# EAGLE design VIVA Audio Amp (EAGLE 6.3)

## Sheet 1 of 2
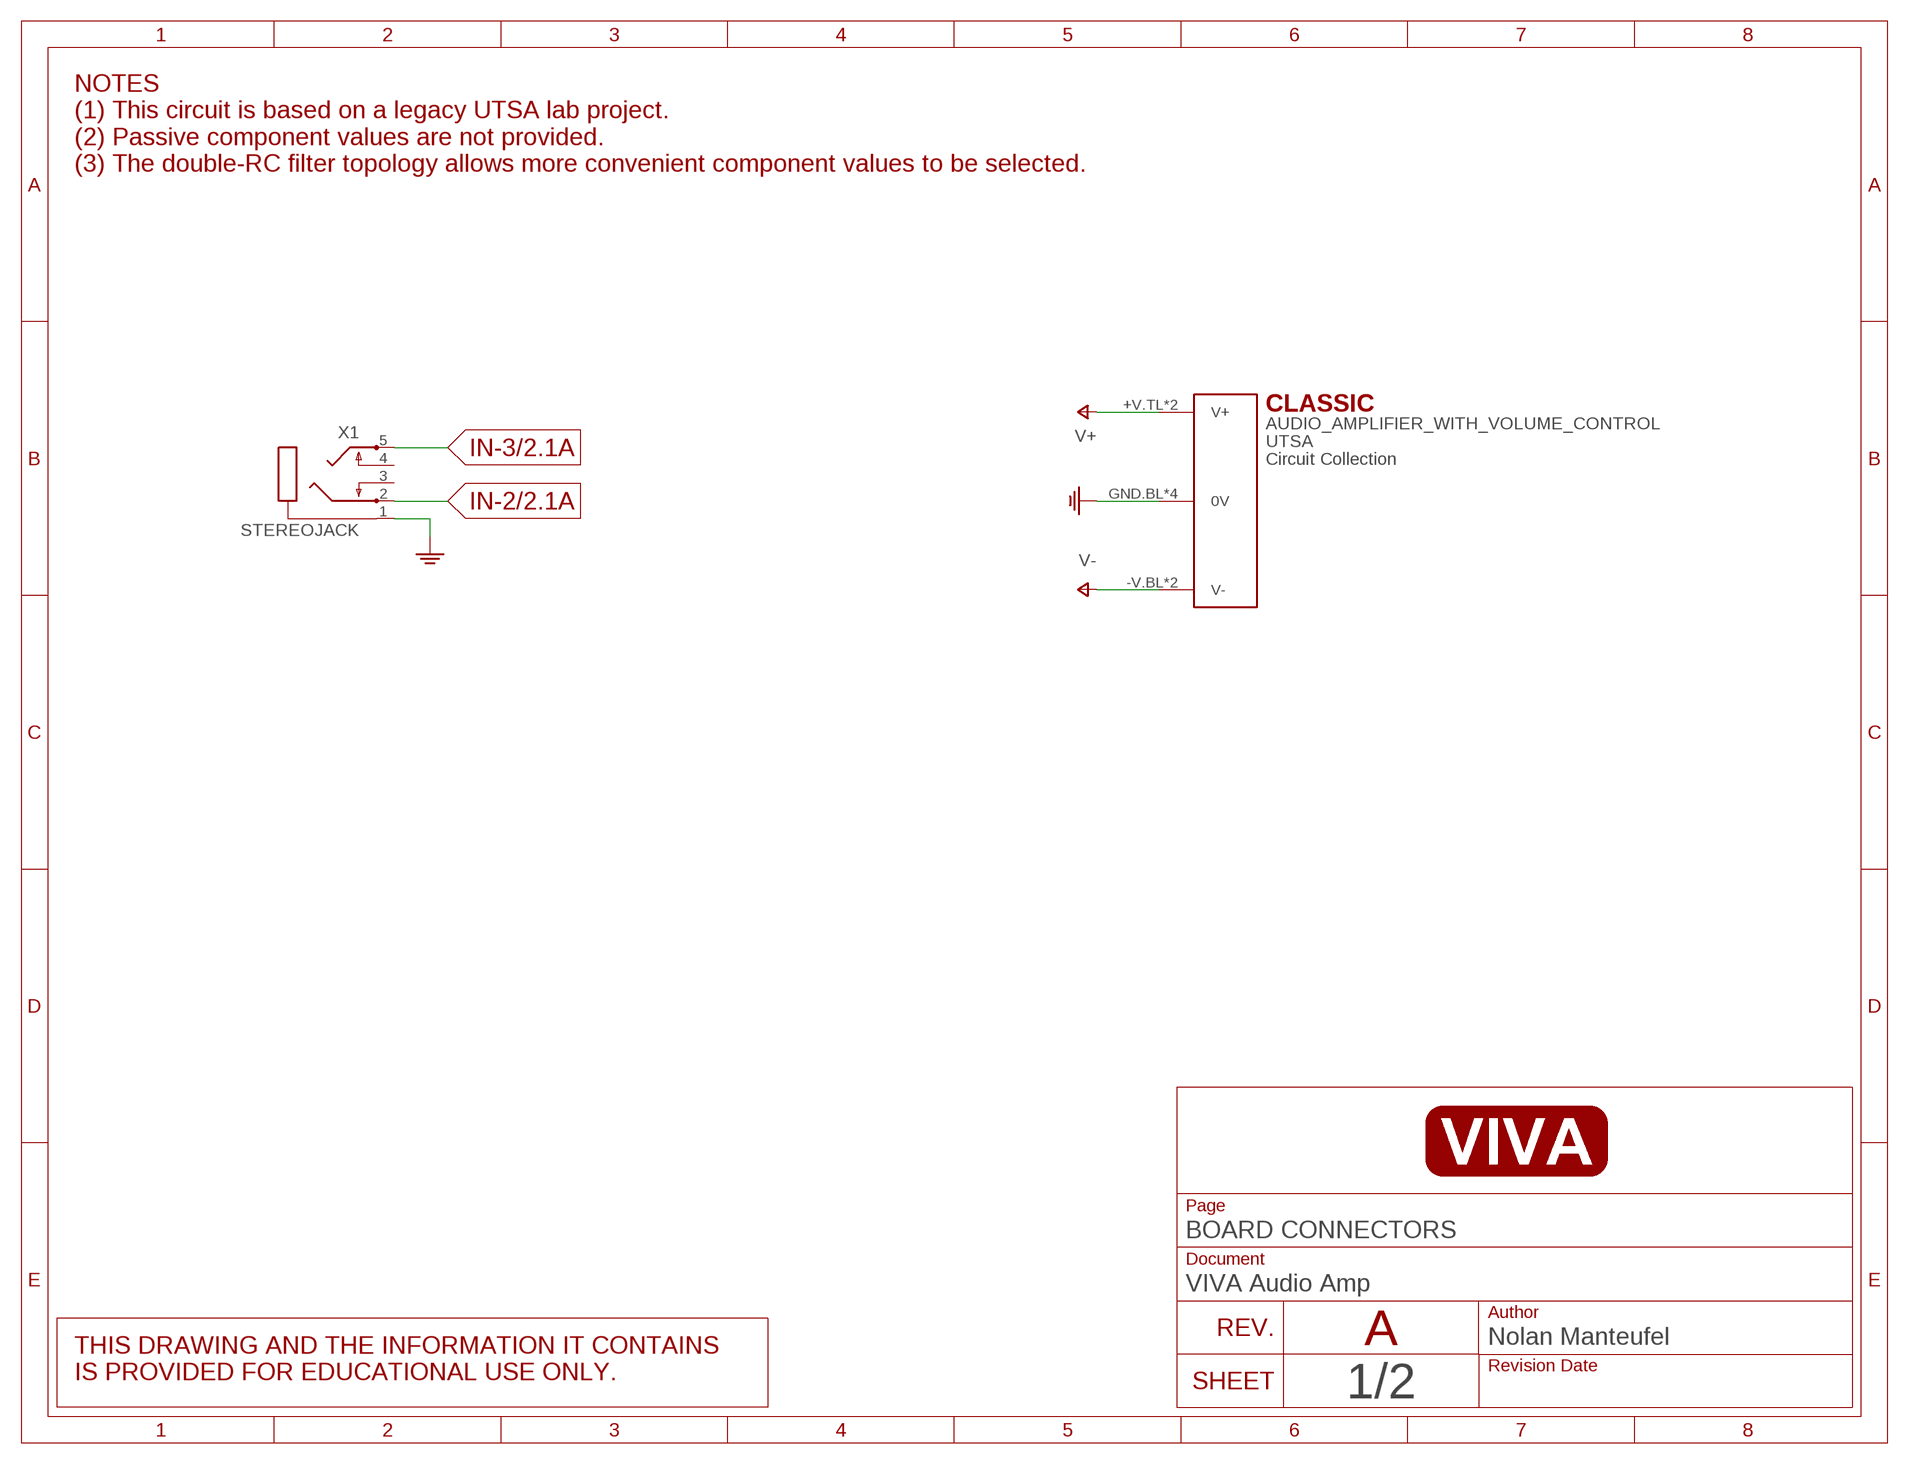
[diagram p0: schematic, sheet 1]

### Parts
AUDIO_AMPLIFIER_WITH_VOLUME_CONTROL  UTSA  CLASSIC_PCB35  [CLASSIC_3-5"]
X1  STEREOJACK  [STX3100]

### Nets
GND: AUDIO_AMPLIFIER_WITH_VOLUME_CONTROL.GND.BL(0V) AUDIO_AMPLIFIER_WITH_VOLUME_CONTROL.GND.BR(0V) AUDIO_AMPLIFIER_WITH_VOLUME_CONTROL.GND.TL(0V) AUDIO_AMPLIFIER_WITH_VOLUME_CONTROL.GND.TR(0V) X1.1 ; also sheet 2
IN-2: X1.2 ; also sheet 2
IN-3: X1.5 ; also sheet 2
V+: AUDIO_AMPLIFIER_WITH_VOLUME_CONTROL.+V.TL(V+) AUDIO_AMPLIFIER_WITH_VOLUME_CONTROL.+V.TR(V+) ; also sheet 2
V-: AUDIO_AMPLIFIER_WITH_VOLUME_CONTROL.-V.BL(V-) AUDIO_AMPLIFIER_WITH_VOLUME_CONTROL.-V.BR(V-) ; also sheet 2
Unconnected: X1.3 X1.4

### Notes on the sheet
- NOTES
  (1) This circuit is based on a legacy UTSA lab project.
  (2) Passive component values are not provided.
  (3) The double-RC filter topology allows more convenient component values to be selected.
- A

## Sheet 2 of 2
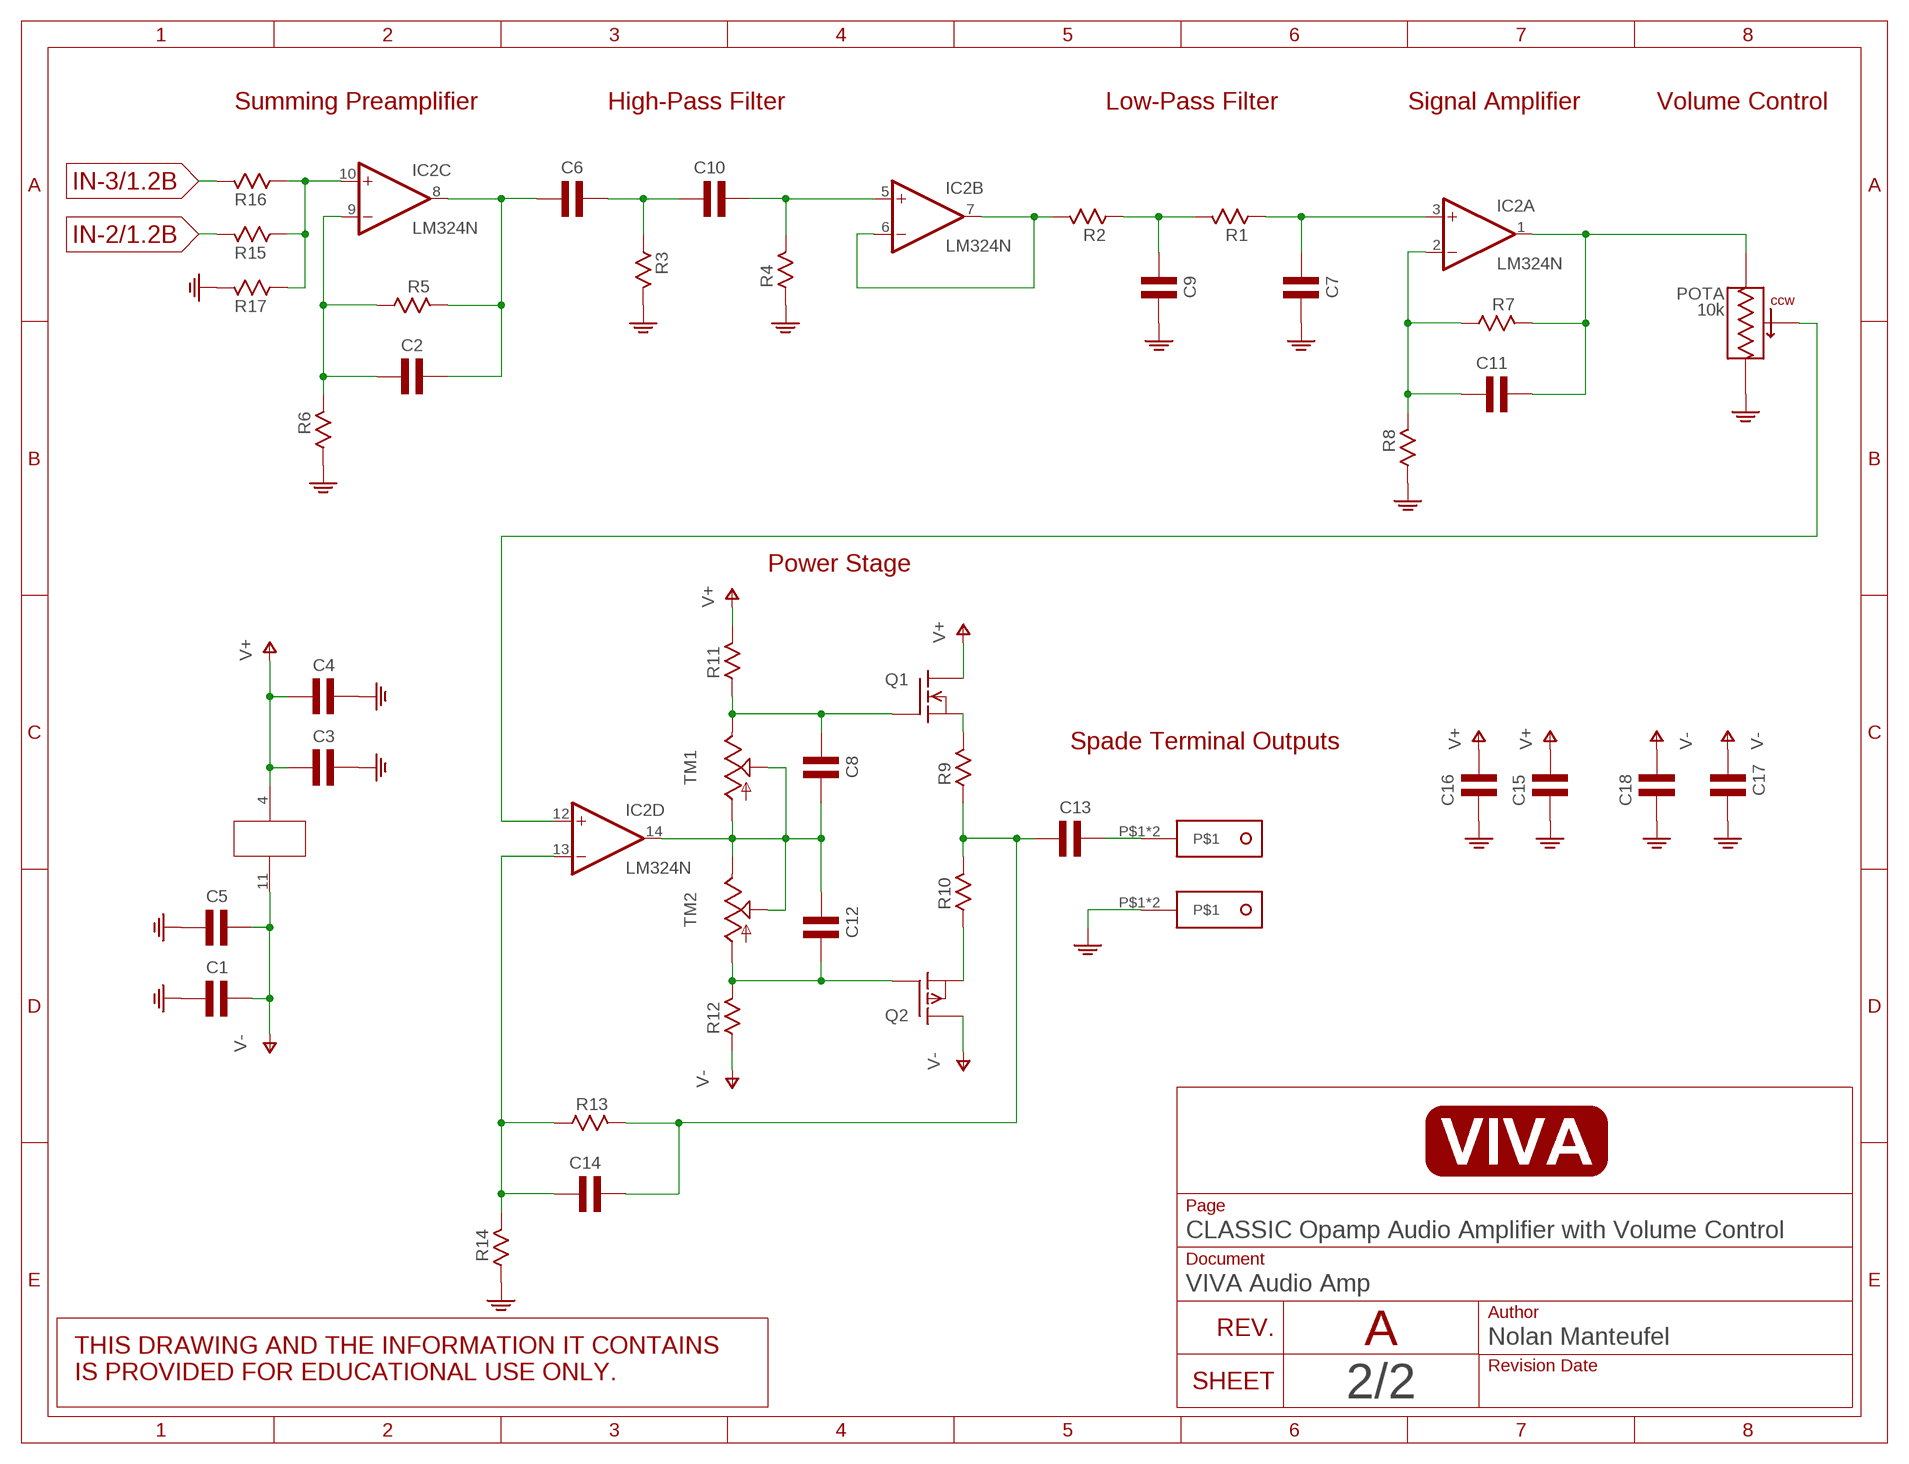
[diagram p1: schematic, sheet 2]

### Parts
C1  COVAL  [C050-024X044]
C2  COVAL  [C050-024X044]
C3  COVAL  [C050-024X044]
C4  C2.5-10  [E2,5-5]
C5  C2.5-10  [E2,5-5]
C6  COVAL  [C050-024X044]
C7  COVAL  [C050-024X044]
C8  COVAL  [C050-024X044]
C9  COVAL  [C050-024X044]
C10  COVAL  [C050-024X044]
C11  COVAL  [C050-024X044]
C12  COVAL  [C050-024X044]
C13  C3.5-10  [E3,5-10]
C14  COVAL  [C050-024X044]
C15  C2.5-10  [E2,5-5]
C16  COVAL  [C050-024X044]
C17  C2.5-10  [E2,5-5]
C18  COVAL  [C050-024X044]
IC2  LM324N  [DIL14]
POT  10k  POTENTIOMETER  [WH148]
Q1  N-MOSFETTO220V  [TO220V]
Q2  P-MOSFETTO220V  [TO220V]
R1  R204-7  [0204/7]
R2  R204-7  [0204/7]
R3  R204-7  [0204/7]
R4  R204-7  [0204/7]
R5  R204-7  [0204/7]
R6  R204-7  [0204/7]
R7  R204-7  [0204/7]
R8  R204-7  [0204/7]
R9  R204-7  [0204/7]
R10  R204-7  [0204/7]
R11  R204-7  [0204/7]
R12  R204-7  [0204/7]
R13  R204-7  [0204/7]
R14  R204-7  [0204/7]
R15  R204-7  [0204/7]
R16  R204-7  [0204/7]
R17  R204-7  [0204/7]
TM1  TRIM6MM  [6MM]
TM2  TRIM6MM  [6MM]
U$2  SPADE-TAB  [SPADE-TAB-6.3MM]
U$3  SPADE-TAB  [SPADE-TAB-6.3MM]

### Nets
GND: C1.1 C3.2 C4.- C5.+ C7.1 C9.1 C15.- C16.2 C17.+ C18.2 POT.4.FL(A:1.L) R3.2 R4.1 R6.2 R8.2 R14.2 R17.1 U$3.P$1 U$3.P$2 ; also sheet 1
IN-2: R15.1 ; also sheet 1
IN-3: R16.1 ; also sheet 1
INPUT: IC2.10(C:+IN) R15.2 R16.2 R17.2
N$1: C9.2 R1.2 R2.1
N$2: C2.2 IC2.9(C:-IN) R5.2 R6.1
N$3: C2.1 C6.2 IC2.8(C:OUT) R5.1
N$4: C7.2 IC2.3(A:+IN) R1.1
N$5: IC2.6(B:-IN) IC2.7(B:OUT) R2.2
N$6: Q2.3(S) R10.1
N$7: C10.1 IC2.5(B:+IN) R4.2
N$8: C6.1 C10.2 R3.1
N$9: C11.1 IC2.1(A:OUT) POT.6.FR(A:3.R) R7.1
N$10: C11.2 IC2.2(A:-IN) R7.2 R8.1
N$11: C8.2 Q1.1(G) R11.1 TM1.E
N$12: C12.1 Q2.1(G) R12.2 TM2.A
N$14: C13.+ C14.1 R9.1 R10.2 R13.1
N$15: Q1.3(S) R9.2
N$16: C13.- U$2.P$1 U$2.P$2
N$17: IC2.12(D:+IN) POT.5.FC(A:2.C)
N$19: C14.2 IC2.13(D:-IN) R13.2 R14.1
N$20: C8.1 C12.2 IC2.14(D:OUT) TM1.A TM1.S TM2.E TM2.S
V+: C3.1 C4.+ C15.+ C16.1 Q1.2(D) R11.2 ; also sheet 1
V-: C1.2 C5.- C17.- C18.1 IC2.11(P:V-) Q2.2(D) R12.1 ; also sheet 1
Unconnected: POT.1.BL(B:1.L) POT.2.BC(B:2.C) POT.3.BR(B:3.R)

### Notes on the sheet
- Summing Preamplifier | High-Pass Filter | Low-Pass Filter | Signal Amplifier | Volume Control
- Power Stage
- Spade Terminal Outputs
- A

## Power pins joined to a net without a drawn wire
V+: IC2.4(P:V+)

## Library data of the parts
AUDIO_AMPLIFIER_WITH_VOLUME_CONTROL = nolan-utsa:CLASSIC_PCB
C1-C18 = nolan-utsa:C
IC2 = nolan-utsa:LM324: OP AMP
POT = nolan-utsa:POTENTIOMETER
Q1 = nolan-utsa:N-MOSFET
Q2 = nolan-utsa:P-MOSFET
R1-R17 = nolan-utsa:R
TM1 TM2 = nolan-utsa:TRIM
U$2 U$3 = nolan-utsa:SPADE-TAB
X1 = adafruit:STEREOJACK: MIC/HEADPHONE JACK Stereo jack with two switches. Kycon STX3100, CUI SJ1-3555NG and/or 4UCon 05544

## Board
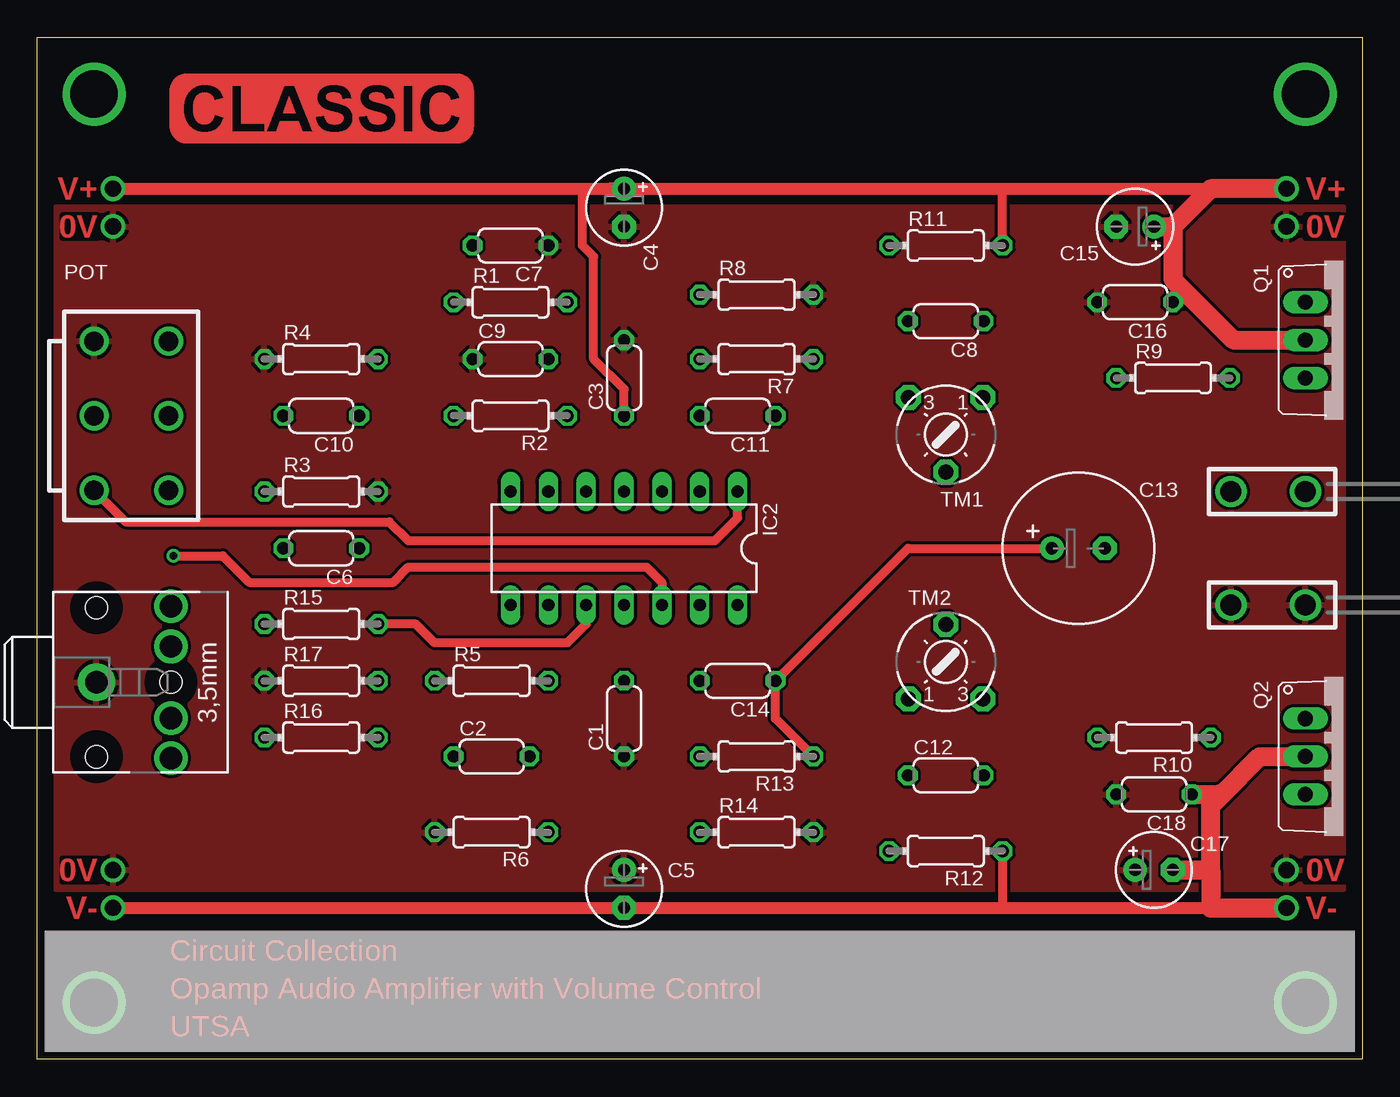
[diagram p2: board, top side]
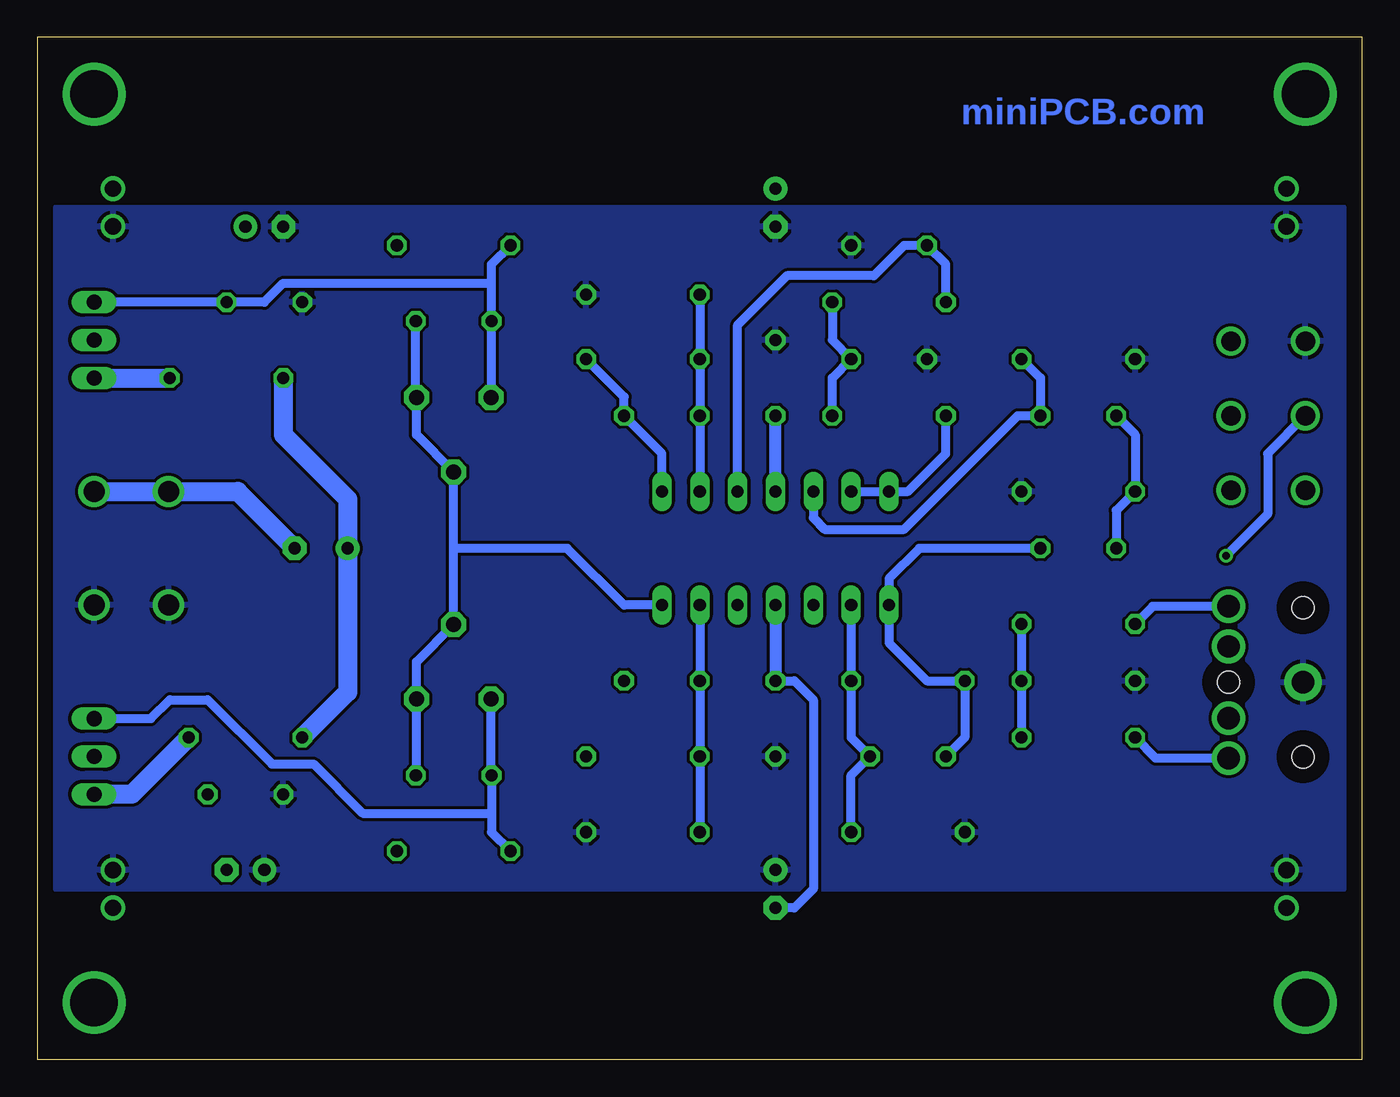
[diagram p3: board, bottom side, seen from below]

Size 88.9 x 68.58 mm. Coordinates in mm from the lower left corner, seen from the top.
Copper layers (1*16): Top 0.035mm / dielectric 1.5mm / Bottom 0.035mm
Design rules "default *": minimum track width 10mil, minimum drill 24mil, track to track 8mil, track to pad 8mil, pad to pad 8mil, via to via 8mil, smd to smd 8mil, copper to edge 40mil, drill to drill 8mil, minimum pad ring 10mil, minimum via ring 8mil, stop-mask expansion 4mil, vias tented up to drill 20mil, thermal gap 10mil

### Footprints (pad centres in the part's own frame; a part is rotated, then mirrored left to right if it is on the bottom)
CLASSIC_3-5" = drill 1.1: +V.TL 5.08,58.42; +V.TR 83.82,58.42; -V.BL 5.08,10.16; -V.BR 83.82,10.16; GND.BL 5.08,12.7; GND.BR 83.82,12.7; GND.TL 5.08,55.88; GND.TR 83.82,55.88 | drill 3.2: H.BL 3.81,3.81; H.BR 85.09,3.81; H.TL 3.81,64.77; H.TR 85.09,64.77
C050-024X044 = drill 0.813 octagon: 1 -2.54,0; 2 2.54,0
E2,5-5 = drill 0.813 pad 1.6: + -1.27,0 | drill 0.813 pad 1.6 octagon: - 1.27,0
E3,5-10 = drill 0.813 pad 1.6: + -1.778,0 | drill 0.813 pad 1.6 octagon: - 1.778,0
DIL14 = drill 0.813 long: 1 -7.62,-3.81; 2 -5.08,-3.81; 3 -2.54,-3.81; 4 0,-3.81; 5 2.54,-3.81; 6 5.08,-3.81; 7 7.62,-3.81; 8 7.62,3.81; 9 5.08,3.81; 10 2.54,3.81; 11 0,3.81; 12 -2.54,3.81; 13 -5.08,3.81; 14 -7.62,3.81
WH148 = drill 1.3: 1.BL -5,5; 2.BC 0,5; 3.BR 5,5; 4.FL -5,0; 5.FC 0,0; 6.FR 5,0
TO220V = drill 1.016 long: 1 -2.54,-2.54; 2 0,-2.54; 3 2.54,-2.54
0204/7 = drill 0.813 octagon: 1 -3.81,0; 2 3.81,0
6MM = drill 1 pad 1.676 octagon: A -2.5,-2.5; E 2.5,-2.5; S 0,2.5
SPADE-TAB-6.3MM = drill 1.4: P$1 0,0; P$2 0,5
STX3100 = drill 1.5 pad 2.54: 1 2.7,-0.1 | drill 1.5: 2 7.7,5; 3 7.7,2.3; 4 7.7,-2.5; 5 7.7,-5.2 | hole 1.5: 2.7,4.9; 2.7,-5.1; 7.7,-0.1

### Placement (x,y rotation side)
AUDIO_AMPLIFIER_WITH_VOLUME_CONTROL  0,0 0 top
C1  39.37,22.86 90 top
C2  30.48,20.32 0 top
C3  39.37,45.72 90 top
C4  39.37,57.15 270 top
C5  39.37,11.43 270 top
C6  19.05,34.29 0 top
C7  31.75,54.61 180 top
C8  60.96,49.53 180 top
C9  31.75,46.99 0 top
C10  19.05,43.18 180 top
C11  46.99,43.18 180 top
C12  60.96,19.05 0 top
C13  69.85,34.29 0 top
C14  46.99,25.4 180 top
C15  73.66,55.88 180 top
C16  73.66,50.8 180 top
C17  74.93,12.7 0 top
C18  74.93,17.78 180 top
IC2  39.37,34.29 180 top
POT  3.81,43.18 270 top
Q1  87.63,48.26 270 top
Q2  87.63,20.32 270 top
R1  31.75,50.8 0 top
R2  31.75,43.18 180 top
R3  19.05,38.1 0 top
R4  19.05,46.99 0 top
R5  30.48,25.4 0 top
R6  30.48,15.24 180 top
R7  48.26,46.99 180 top
R8  48.26,51.31 0 top
R9  76.2,45.72 0 top
R10  74.93,21.59 180 top
R11  60.96,54.61 0 top
R12  60.96,13.97 180 top
R13  48.26,20.32 180 top
R14  48.26,15.24 0 top
R15  19.05,29.21 0 top
R16  19.05,21.59 0 top
R17  19.05,25.4 0 top
TM1  60.96,41.91 180 top
TM2  60.96,26.67 0 top
U$2  85.09,38.1 90 top
U$3  85.09,30.48 90 top
X1  1.27,25.4 0 top

### Tracks (layer width: path | path; a pad name or v marks a point on that pad's centre or on a via)
GND
  pour Bottom: 1.27,11.43 87.63,11.43 87.63,57.15 1.27,57.15
  pour Top: 1.27,11.43 87.63,11.43 87.63,57.15 1.27,57.15
IN-2
  Bottom 0.61: X1.2 14.05,30.4 R15.1
IN-3
  Bottom 0.61: X1.5 13.85,20.2 R16.1
INPUT
  Top 0.61: IC2.10 36.83,29.21 35.56,27.94 26.67,27.94 25.4,29.21 R15.2
  Bottom 0.61: R15.2 R17.2 R16.2
N$1
  Bottom 0.61: R2.1 35.56,45.72 C9.2 35.56,48.26 R1.2
N$2
  Bottom 0.61: IC2.9 R5.2 34.29,21.59 C2.2 34.29,19.05 R6.1
N$3
  Bottom 0.61: C6.2 29.72,34.29 31.75,32.26 IC2.8 31.75,27.94 29.21,25.4 R5.1 26.67,21.59 C2.1
N$4
  Bottom 0.61: IC2.3 41.91,49.28 38.61,52.58 32.77,52.58 30.73,54.61 C7.2 27.94,53.34 R1.1
N$5
  Bottom 0.61: IC2.6 IC2.7 30.48,38.1 27.94,40.64 R2.2
N$6
  Bottom 1.27: R10.1 82.55,17.78 Q2.3
N$7
  Bottom 0.61: R4.2 21.59,45.72 C10.1 23.11,43.18 30.73,35.56 36.07,35.56 36.83,36.32 IC2.5
N$8
  Bottom 0.61: C10.2 15.24,41.91 R3.1 16.51,36.83 C6.1
N$9
  Top 0.61: POT.6.FR 5.92,36.07 23.62,36.07 24.89,34.8 45.47,34.8 46.99,36.32 IC2.1
  Bottom 0.61: IC2.1 46.99,40.64 C11.1 49.53,44.45 R7.1
N$10
  Bottom 0.61: R8.1 R7.2 C11.2 IC2.2
N$11
  Bottom 0.61: TM1.E 58.42,44.45 C8.2 58.42,52.07 | Q1.1 73.66,50.8 72.39,52.07 58.42,52.07 | 58.42,52.07 58.42,53.34 R11.1
N$12
  Bottom 0.61: TM2.A 58.46,19.09 C12.1 58.42,16.51 | 58.42,16.51 58.42,15.24 R12.2 | Q2.1 81.28,22.86 80.01,24.13 77.47,24.13 73.15,19.81 70.36,19.81 67.06,16.51 58.42,16.51
N$14
  Top 0.61: C13.+ 58.42,34.29 C14.1 49.53,22.86 R13.1
  Bottom 1.27: R9.1 72.39,41.91 68.07,37.59 C13.+ 68.07,24.64 R10.2
N$15
  Bottom 1.27: Q1.3 R9.2
N$16
  Bottom 1.27: U$2.P$1 U$2.P$2 75.44,38.1 C13.-
N$17  (via drill 0.5)
  Top 0.61: v9.14,33.78 12.45,33.78 14.22,32 23.88,32 24.89,33.02 40.89,33.02 41.91,32 IC2.12
  Bottom 0.61: POT.5.FC 6.35,40.64 6.35,36.58 v9.14,33.78
N$19
  Bottom 0.61: IC2.13 C14.2 R13.2 R14.1
N$20
  Bottom 0.61: IC2.14 49.53,30.48 53.34,34.29 60.96,34.29 | 60.96,34.29 TM2.S 63.46,26.67 TM2.E 63.46,19.09 C12.2 | 60.96,34.29 TM1.S 63.46,41.91 TM1.A 63.5,44.45 C8.1
V+
  Top 0.61: C3.1 39.37,44.96 37.34,46.99 37.34,53.85 36.58,54.61 36.58,58.42 | 36.58,58.42 38.35,58.42 | 36.58,58.42 AUDIO_AMPLIFIER_WITH_VOLUME_CONTROL.+V.TL | R11.2 64.77,58.42 78.74,58.42
  Top 0.813: C4.+ 38.35,58.42
  Top 1.27: AUDIO_AMPLIFIER_WITH_VOLUME_CONTROL.+V.TR 78.74,58.42 76.2,55.88 | 76.2,55.88 76.2,52.32 76.96,51.56 | 76.96,51.56 80.26,48.26 Q1.2 | C16.1 76.96,51.56 | C15.+ 76.2,55.88
  Bottom 0.813: IC2.4 C3.1
V-
  Top 0.61: AUDIO_AMPLIFIER_WITH_VOLUME_CONTROL.-V.BL C5.- | R12.1 64.77,10.16 78.74,10.16
  Top 1.27: 78.74,12.7 78.74,10.16 AUDIO_AMPLIFIER_WITH_VOLUME_CONTROL.-V.BR | C17.- 78.74,12.7 | 78.74,12.7 78.74,17.02 79.38,17.65 | C18.1 79.25,17.78 79.38,17.65 | 79.38,17.65 82.04,20.32 Q2.2
  Bottom 0.61: C1.2 38.1,25.4 36.83,24.13 36.83,11.43 38.1,10.16 C5.-
  Bottom 0.813: IC2.11 C1.2

### Text on the board
Top: Opamp Audio Amplifier with Volume Control
tStop: Opamp Audio Amplifier with Volume Control